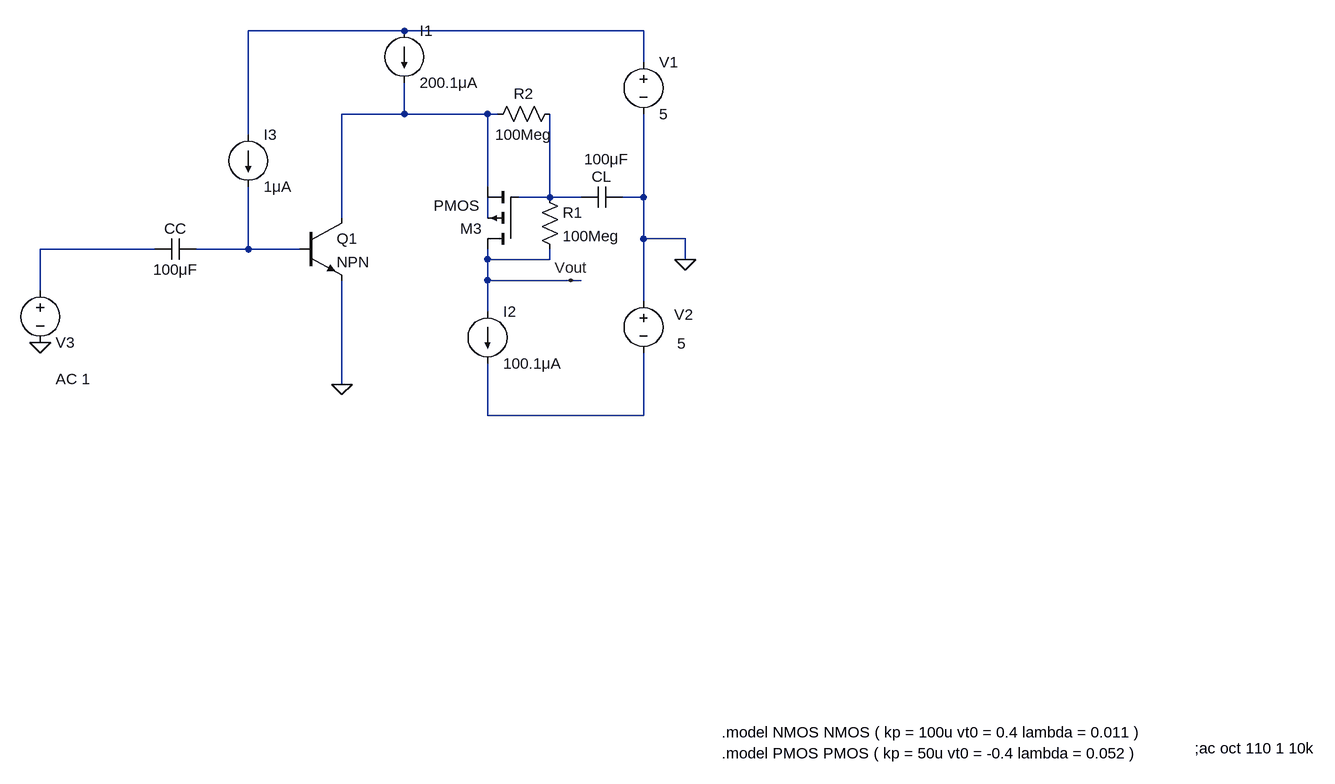
[diagram p0: schematic LTSpice Schematic - 2 Stage Op-Amp.asc]
LTSpice Schematic - 2 Stage Op-Amp.asc, the LTspice schematic file:
Version 4
SHEET 1 2416 1016
WIRE -1040 -112 -1280 -112
WIRE -672 -112 -1040 -112
WIRE -672 -64 -672 -112
WIRE -1040 16 -1040 -32
WIRE -1040 16 -1136 16
WIRE -912 16 -1040 16
WIRE -896 16 -912 16
WIRE -1280 48 -1280 -112
WIRE -912 128 -912 16
WIRE -816 144 -816 16
WIRE -816 144 -864 144
WIRE -768 144 -816 144
WIRE -672 144 -672 16
WIRE -672 144 -704 144
WIRE -1136 176 -1136 16
WIRE -912 176 -912 144
WIRE -672 208 -672 144
WIRE -608 208 -672 208
WIRE -1424 224 -1600 224
WIRE -1280 224 -1280 128
WIRE -1280 224 -1360 224
WIRE -1200 224 -1280 224
WIRE -912 240 -912 224
WIRE -816 240 -816 224
WIRE -816 240 -912 240
WIRE -608 240 -608 208
WIRE -912 272 -912 240
WIRE -784 272 -912 272
WIRE -768 272 -784 272
WIRE -1600 288 -1600 224
WIRE -672 304 -672 208
WIRE -912 320 -912 272
WIRE -1136 432 -1136 272
WIRE -912 480 -912 400
WIRE -672 480 -672 384
WIRE -672 480 -912 480
FLAG -608 240 0
FLAG -1600 368 0
FLAG -784 272 Vout
FLAG -1136 432 0
SYMBOL pmos4 -864 224 R180
WINDOW 3 60 67 Left 2
SYMATTR InstName M3
SYMATTR Value2 l=520n w=1661.52u
SYMBOL voltage -672 -80 R0
WINDOW 123 0 0 Left 2
WINDOW 39 0 0 Left 2
SYMATTR InstName V1
SYMATTR Value 5
SYMBOL voltage -672 288 R0
WINDOW 123 52 81 Left 2
WINDOW 39 0 0 Left 2
WINDOW 3 -99 106 Left 2
WINDOW 0 47 37 Left 2
SYMATTR Value2 5
SYMATTR Value ""
SYMATTR InstName V2
SYMBOL voltage -1600 272 R0
WINDOW 0 24 96 Left 2
WINDOW 3 24 124 Left 2
WINDOW 123 24 152 Left 2
WINDOW 39 0 0 Left 2
SYMATTR InstName V3
SYMATTR Value ""
SYMATTR Value2 AC 1
SYMBOL cap -704 128 R90
WINDOW 0 0 32 VBottom 2
WINDOW 3 -58 25 VTop 2
SYMATTR InstName CL
SYMATTR Value 100μF
SYMBOL cap -1360 208 R90
WINDOW 0 0 32 VBottom 2
WINDOW 3 32 32 VTop 2
SYMATTR InstName CC
SYMATTR Value 100μF
SYMBOL current -1040 -112 R0
SYMATTR InstName I1
SYMATTR Value 200.1μA
SYMBOL current -912 320 R0
WINDOW 123 0 0 Left 0
WINDOW 39 0 0 Left 0
SYMATTR InstName I2
SYMATTR Value 100.1μA
SYMBOL current -1280 48 R0
WINDOW 123 0 0 Left 0
WINDOW 39 0 0 Left 0
SYMATTR InstName I3
SYMATTR Value 1μA
SYMBOL npn -1200 176 R0
SYMATTR InstName Q1
SYMBOL res -832 128 R0
SYMATTR InstName R1
SYMATTR Value 100Meg
SYMBOL res -800 0 R90
WINDOW 0 0 56 VBottom 2
WINDOW 3 32 56 VTop 2
SYMATTR InstName R2
SYMATTR Value 100Meg
TEXT 176 992 Left 2 !;ac oct 110 1 10k
TEXT -552 968 Left 2 !.model NMOS NMOS ( kp = 100u vt0 = 0.4 lambda = 0.011 )
TEXT -552 1000 Left 2 !.model PMOS PMOS ( kp = 50u vt0 = -0.4 lambda = 0.052 )

The netlist it stands for:
* LTSpice Schematic - 2 Stage Op-Amp.asc
M3 Vout N003 N002 N004 PMOS l=520n w=1661.52u
V1 N001 0 5
V2 0 N007 5
V3 N005 0 AC 1
CL 0 N003 100μF
CC N006 N005 100μF
I1 N001 N002 200.1μA
I2 Vout N007 100.1μA
I3 N001 N006 1μA
Q1 N002 N006 0 0 NPN
R1 N003 Vout 100Meg
R2 N003 N002 100Meg
.model NPN NPN
.model PNP PNP
.lib standard.bjt
.model NMOS NMOS
.model PMOS PMOS
.lib standard.mos
;ac oct 110 1 10k
.model NMOS NMOS ( kp = 100u vt0 = 0.4 lambda = 0.011 )
.model PMOS PMOS ( kp = 50u vt0 = -0.4 lambda = 0.052 )
.backanno
.end